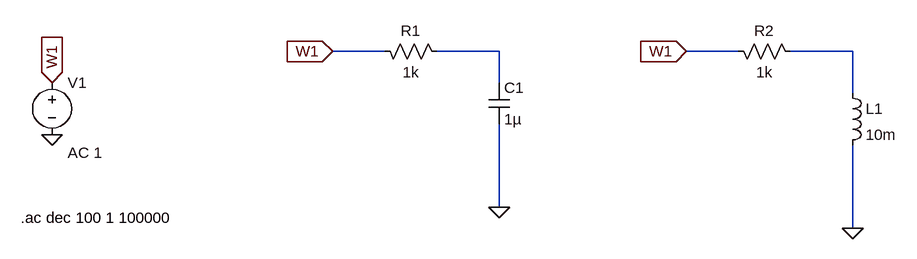
[diagram p0: schematic lpf_hpf_ltspice.asc]
lpf_hpf_ltspice.asc, the LTspice schematic file:
Version 4
SHEET 1 1100 680
WIRE 304 80 224 80
WIRE 480 80 384 80
WIRE 848 80 768 80
WIRE 1024 80 928 80
WIRE 480 128 480 80
WIRE 1024 144 1024 80
WIRE 480 320 480 192
WIRE 1024 352 1024 224
FLAG 480 320 0
FLAG 1024 352 0
FLAG -208 208 0
FLAG -208 128 W1
IOPIN -208 128 In
FLAG 224 80 W1
IOPIN 224 80 In
FLAG 768 80 W1
IOPIN 768 80 In
SYMBOL res 288 64 M90
WINDOW 0 0 56 VBottom 2
WINDOW 3 32 56 VTop 2
SYMATTR InstName R1
SYMATTR Value 1k
SYMBOL cap 464 128 R0
SYMATTR InstName C1
SYMATTR Value 1µ
SYMBOL voltage -208 112 R0
WINDOW 123 24 124 Left 2
WINDOW 39 0 0 Left 0
SYMATTR Value2 AC 1
SYMATTR InstName V1
SYMATTR Value ""
SYMBOL res 832 64 M90
WINDOW 0 0 56 VBottom 2
WINDOW 3 32 56 VTop 2
SYMATTR InstName R2
SYMATTR Value 1k
SYMBOL ind 1008 128 R0
SYMATTR InstName L1
SYMATTR Value 10m
TEXT -256 336 Left 2 !.ac dec 100 1 100000

The netlist it stands for:
* lpf_hpf_ltspice.asc
R1 W1 N001 1k
C1 N001 0 1µ
V1 W1 0 AC 1
R2 W1 N002 1k
L1 N002 0 10m
.ac dec 100 1 100000
.backanno
.end